# EAGLE design power_board (EAGLE 8.0.2)
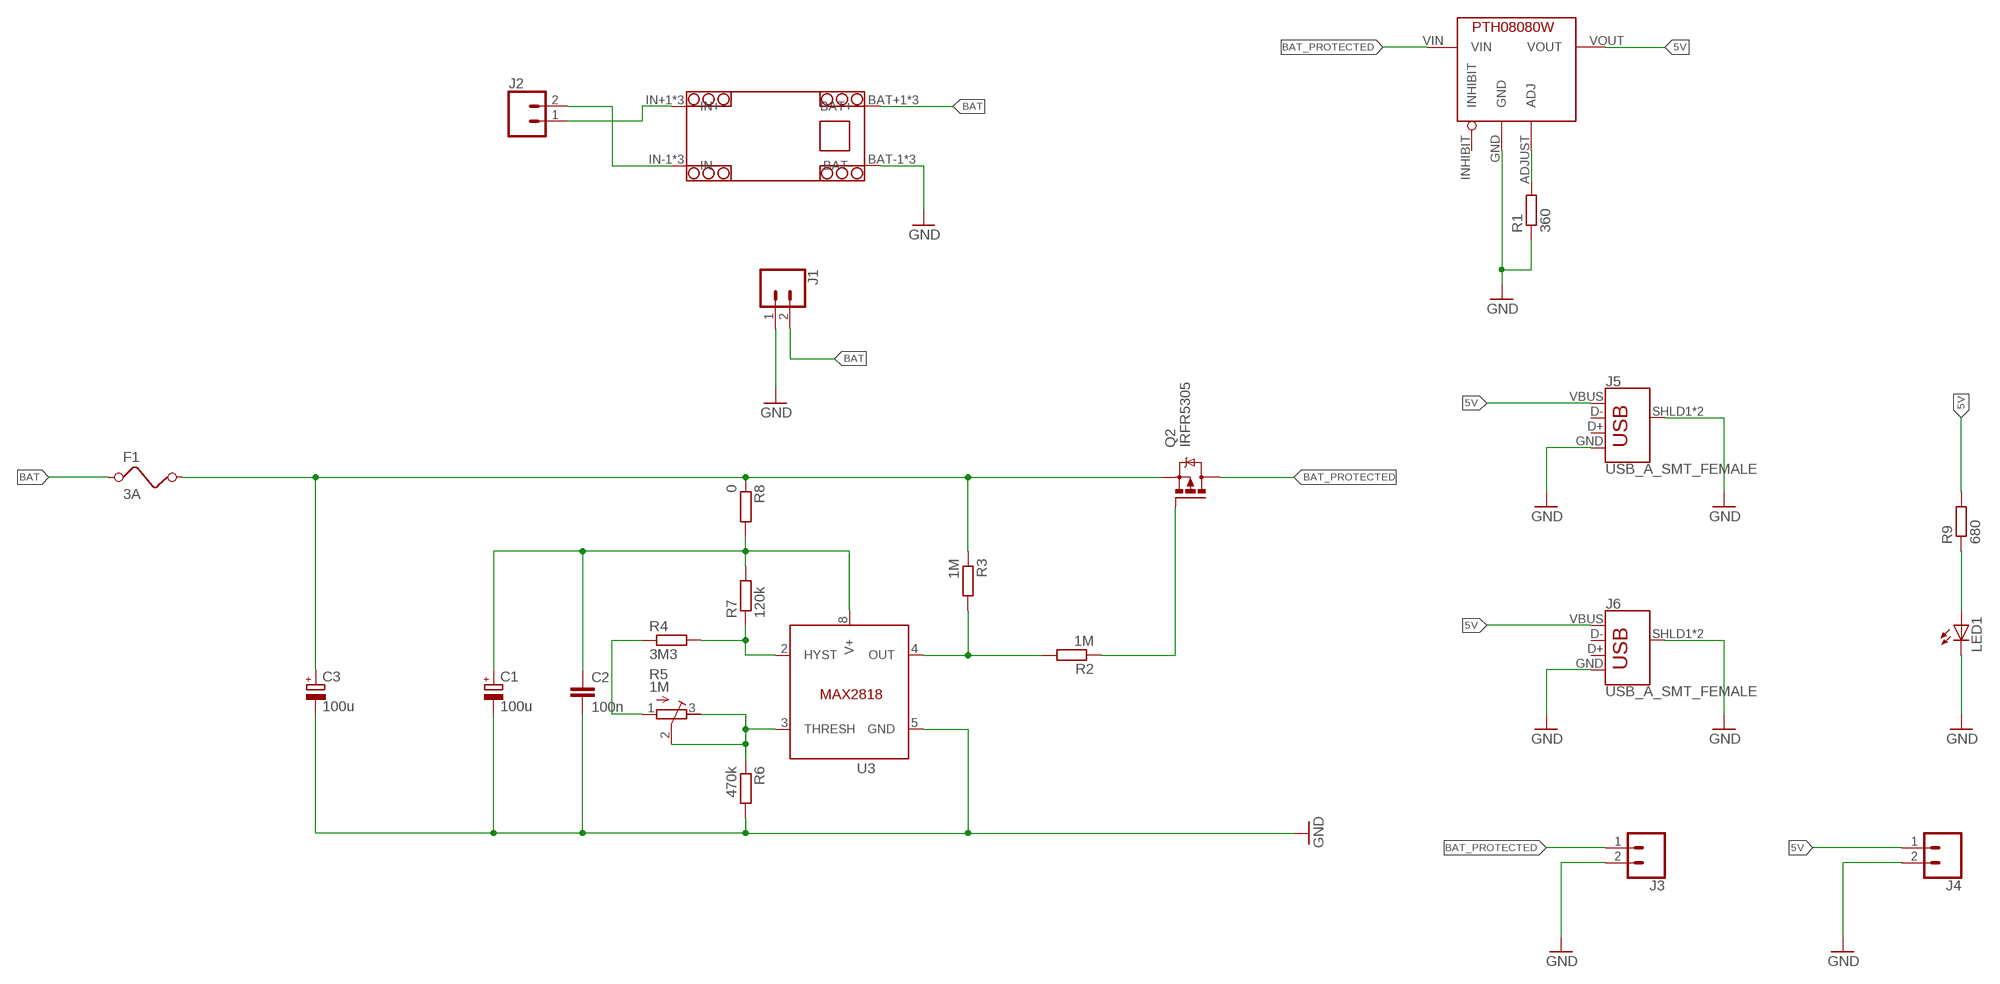
[diagram p0: schematic, sheet 1]

## Parts
C1  100u  CPOL-EUE3.5-8  [E3,5-8]
C2  100n  C-EUC1206  [C1206]
C3  100u  CPOL-EUE3.5-8  [E3,5-8]
F1  3A  FUSE  [FUSE]
J1  CONN_025MM  [SCREWTERMINAL-5MM-2]
J2  CONN_025MM  [SCREWTERMINAL-5MM-2]
J3  CONN_02  [1X02]
J4  CONN_025MM  [SCREWTERMINAL-5MM-2]
J5  USB_A_SMT_FEMALE  [USB-A-S-SILK-FEMALE]
J6  USB_A_SMT_FEMALE  [USB-A-S-SILK-FEMALE]
LED1  LED3MM  [LED3MM]
Q2  IRFR5305  [D-PAK_TO252AA]
R1  360  R-EU_R1206  [R1206]
R2  1M  R-EU_R1206  [R1206]
R3  1M  R-EU_R1206  [R1206]
R4  3M3  R-EU_R1206  [R1206]
R5  1M  R-TRIMM64Y  [RTRIM64Y]
R6  470k  R-EU_R1206  [R1206]
R7  120k  R-EU_R1206  [R1206]
R8  0  R-EU_R1206  [R1206]
R9  680  R-EU_R1206  [R1206]
U1  YZXSTUDIO_SOLARCHARGERDEFAULT  [YZXSTUDIO_SOLARCHARGER]
U2  PTH08080WPTH08080W  [PTH08080W]
U3  MAX2812MAX2812_SOIC8  [SOIC127P600X175-8N]

## Nets
5V: J4.1 J5.VBUS J6.VBUS R9.2 U2.VOUT
BAT: F1.1 J1.2 U1.BAT+1(BAT+) U1.BAT+2(BAT+) U1.BAT+3(BAT+)
BAT_FUSED: C3.+ F1.2 Q2.3(S) R3.1 R8.1
BAT_PROTECTED: J3.1 Q2.4(D) U2.VIN
GND: C1.- C2.2 C3.- J1.1 J3.2 J4.2 J5.GND J5.SHLD1(SHIELD) J5.SHLD2(SHIELD) J6.GND J6.SHLD1(SHIELD) J6.SHLD2(SHIELD) LED1.K(C) R1.1 R6.2 U1.BAT-1(BAT-) U1.BAT-2(BAT-) U1.BAT-3(BAT-) U2.GND U3.5(GND)
N$1: J2.2 U1.IN-1(IN-) U1.IN-2(IN-) U1.IN-3(IN-)
N$2: J2.1 U1.IN+1(IN+) U1.IN+2(IN+) U1.IN+3(IN+)
N$4: R1.2 U2.ADJUST(ADJ)
N$5: R5.2(S) R5.3(E) R6.1 U3.3(THRESH)
N$6: R2.2 R3.2 U3.4(OUT)
N$7: Q2.1(G) R2.1
N$8: C1.+ C2.1 R7.2 R8.2 U3.8(V+)
N$9: R4.2 R7.1 U3.2(HYST)
N$10: R4.1 R5.1(A)
N$12: LED1.A R9.1
Unconnected: J5.D+ J5.D- J6.D+ J6.D- U2.INHIBIT

## Library data of the parts
C1 C3 = rcl:CPOL-EU: POLARIZED CAPACITOR, European symbol
C2 = rcl:C-EU: CAPACITOR, European symbol
F1 = special:FUSE: FUSE 5 x 20 mm
J1 J2 J4 = SparkFun-Connectors:CONN_02: Multi connection point. Often used as Generic Header-pin footprint for 0.1 inch spaced/style header connections On any of the 0.1 inch spaced packages, you can populate with these: Break Away Headers - Straight <https://www.sparkfun.com/products/116> (PRT-00116) Break Away Male Headers - Right Angle <https://www.sparkfun.com/products/553> (PRT-00553) Female Headers <https://www.sparkfun.com/products/115> (PRT-00115) Break Away Headers - Machine Pin <https://www.sparkfun.com/products/117> (PRT-00117) Break Away Female Headers - Swiss Machine Pin <https://www.sparkfun.com/products/743> (PRT-00743) For SCREWTERMINALS and SPRING TERMINALS visit here: Screw Terimnals on SparkFun.com <https://www.sparkfun.com/search/results?term=Screw+Terminals> (5mm/3.5mm/2.54mm spacing) This device is also useful as a general connection point to wire up your design to another part of your project. Our various solder wires solder well into these plated through hole pads. Hook-Up Wire - Assortment (Stranded, 22 AWG) <https://www.sparkfun.com/products/11375> (PRT-11375) Hook-Up Wire - Assortment (Solid Core, 22 AWG) <https://www.sparkfun.com/products/11367> (PRT-11367) View the entire wire category on our website here <https://www.sparkfun.com/categories/141> Special notes: Molex polarized connector foot print use with: PRT-08233 with associated crimp pins and housings. 2.54_SCREWTERM for use with PRT-10571. 3.5mm Screw Terminal footprints for PRT-08084 5mm Screw Terminal footprints for use with PRT-08432; SF_SKU: PRT-08432
J3 = SparkFun-Connectors:CONN_02: Multi connection point. Often used as Generic Header-pin footprint for 0.1 inch spaced/style header connections On any of the 0.1 inch spaced packages, you can populate with these: Break Away Headers - Straight <https://www.sparkfun.com/products/116> (PRT-00116) Break Away Male Headers - Right Angle <https://www.sparkfun.com/products/553> (PRT-00553) Female Headers <https://www.sparkfun.com/products/115> (PRT-00115) Break Away Headers - Machine Pin <https://www.sparkfun.com/products/117> (PRT-00117) Break Away Female Headers - Swiss Machine Pin <https://www.sparkfun.com/products/743> (PRT-00743) For SCREWTERMINALS and SPRING TERMINALS visit here: Screw Terimnals on SparkFun.com <https://www.sparkfun.com/search/results?term=Screw+Terminals> (5mm/3.5mm/2.54mm spacing) This device is also useful as a general connection point to wire up your design to another part of your project. Our various solder wires solder well into these plated through hole pads. Hook-Up Wire - Assortment (Stranded, 22 AWG) <https://www.sparkfun.com/products/11375> (PRT-11375) Hook-Up Wire - Assortment (Solid Core, 22 AWG) <https://www.sparkfun.com/products/11367> (PRT-11367) View the entire wire category on our website here <https://www.sparkfun.com/categories/141> Special notes: Molex polarized connector foot print use with: PRT-08233 with associated crimp pins and housings. 2.54_SCREWTERM for use with PRT-10571. 3.5mm Screw Terminal footprints for PRT-08084 5mm Screw Terminal footprints for use with PRT-08432
J5 J6 = SparkFun-Connectors:USB_A: USB-A Connector Male and female variants, as well as PTH and SMT variants SparkFun Products: SparkFun XBee Explorer Dongle <https://www.sparkfun.com/products/11697> PTH Male SparkFun MicroView-USB Programmer <https://www.sparkfun.com/products/12924> SMT Male SparkFun USB Type A Female Breakout <https://www.sparkfun.com/products/12700> SMT Female; PROD_ID: CONN-09520; SF_ID: PRT-09011
LED1 = adafruit:LED: LED OSRAM: - CHIPLED LG R971, LG N971, LY N971, LG Q971, LY Q971, LO R971, LY R971 LH N974, LH R974 LS Q976, LO Q976, LY Q976 LO Q996 - Hyper CHIPLED LW Q18S LB Q993, LB Q99A, LB R99A - SideLED LS A670, LO A670, LY A670, LG A670, LP A670 LB A673, LV A673, LT A673, LW A673 LH A674 LY A675 LS A676, LA A676, LO A676, LY A676, LW A676 LS A679, LY A679, LG A679 - Hyper Micro SIDELED® LS Y876, LA Y876, LO Y876, LY Y876 LT Y87S - SmartLED LW L88C, LW L88S LB L89C, LB L89S, LG L890 LS L89K, LO L89K, LY L89K LS L896, LA L896, LO L896, LY L896 - TOPLED LS T670, LO T670, LY T670, LG T670, LP T670 LSG T670, LSP T670, LSY T670, LOP T670, LYG T670 LG T671, LOG T671, LSG T671 LB T673, LV T673, LT T673, LW T673 LH T674 LS T676, LA T676, LO T676, LY T676, LB T676, LH T676, LSB T676, LW T676 LB T67C, LV T67C, LT T67C, LS T67K, LO T67K, LY T67K, LW E67C LS E67B, LA E67B, LO E67B, LY E67B, LB E67C, LV E67C, LT E67C LW T67C LS T679, LY T679, LG T679 LS T770, LO T770, LY T770, LG T770, LP T770 LB T773, LV T773, LT T773, LW T773 LH T774 LS E675, LA E675, LY E675, LS T675 LS T776, LA T776, LO T776, LY T776, LB T776 LHGB T686 LT T68C, LB T68C - Hyper Mini TOPLED® LB M676 - Mini TOPLED Santana® LG M470 LS M47K, LO M47K, LY M47K Source: http://www.osram.convergy.de/
Q2 = transistor-power:IRF?5305: HEXFET Power MOSFET Source: http://www.irf.com/product-info/datasheets/data/irfr5305pbf.pdf
R1-R4 R6-R9 = rcl:R-EU_: RESISTOR, European symbol
R5 = rcl:R-TRIMM: Trimm resistor
U1 = custom_adluc:YZXSTUDIO_SOLARCHARGER
U2 = custom_adluc:PTH08080W
U3 = custom_adluc:MAX2812

## Board
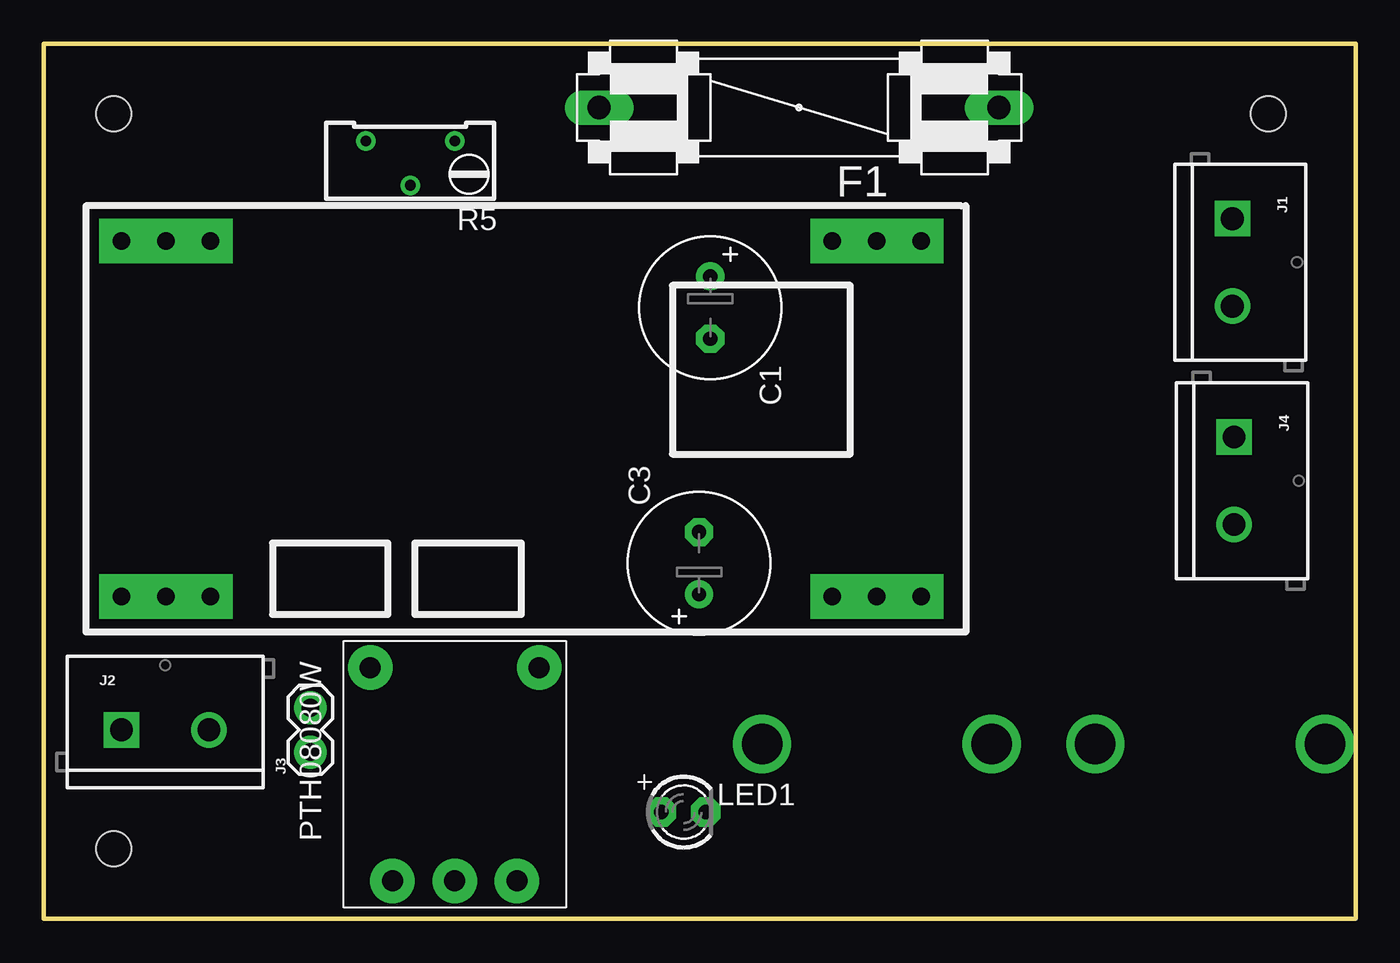
[diagram p1: board, top side]
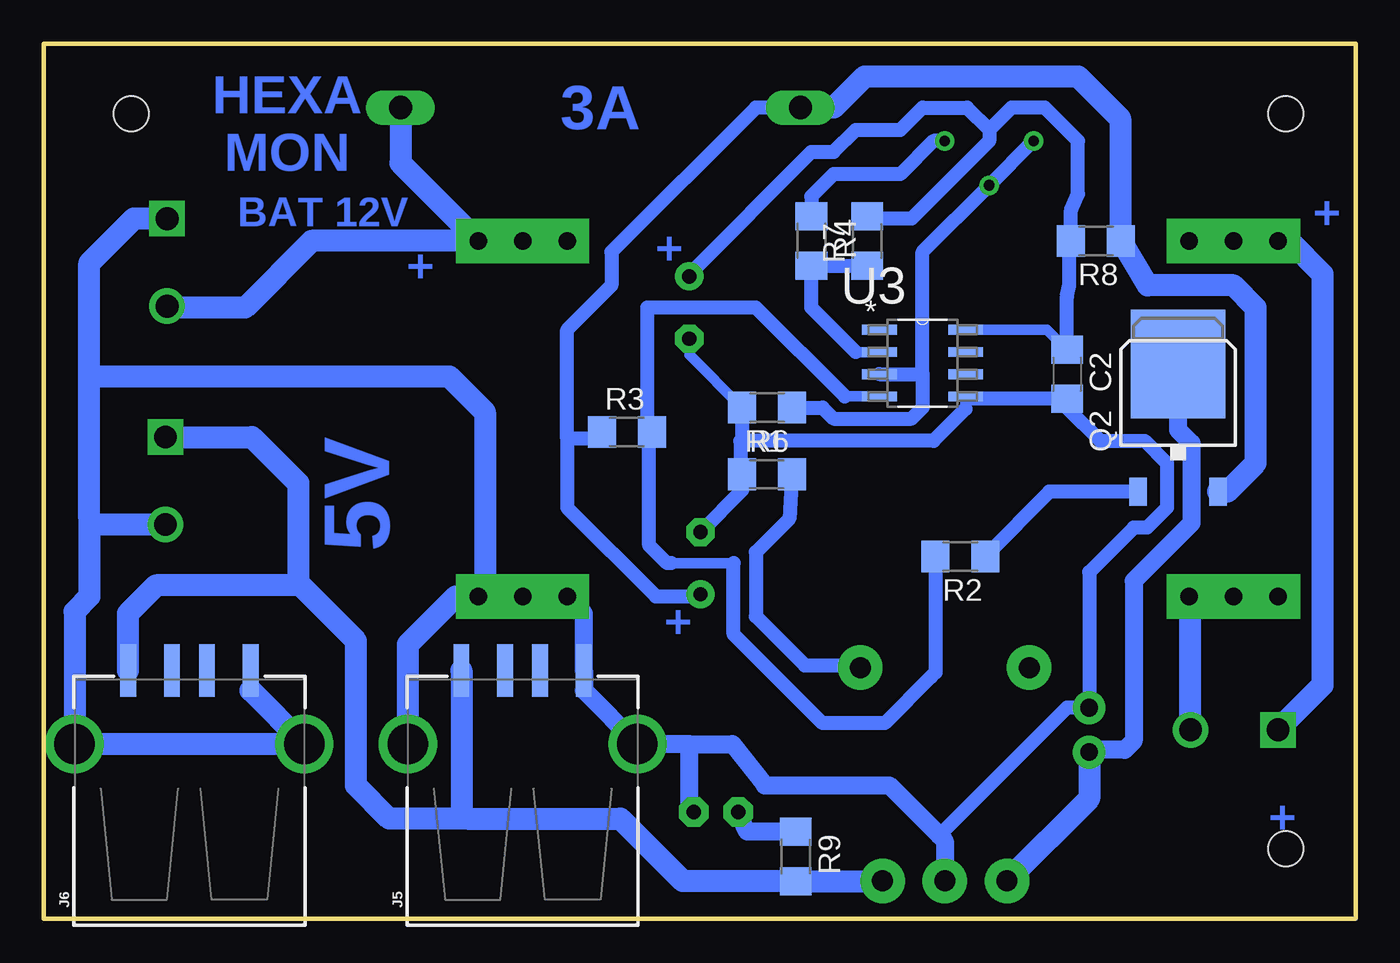
[diagram p2: board, bottom side, seen from below]

Size 75 x 50 mm. Coordinates in mm from the lower left corner, seen from the top.
Outline: 0,0 75,0 75,50 0,50 0,0
Copper layers (1*16): Top 0.035mm / dielectric 1.5mm / Bottom 0.035mm
Design rules "default *": minimum track width 10mil, minimum drill 24mil, track to track 0.5mm, track to pad 0.5mm, pad to pad 8mil, via to via 8mil, smd to smd 8mil, copper to edge 40mil, drill to drill 8mil, minimum pad ring 10mil, minimum via ring 8mil, stop-mask expansion 4mil, vias tented up to drill 0mil, thermal gap 10mil
Holes 2 mm at 4,46 70,46 4,4

### Footprints (pad centres in the part's own frame; a part is rotated, then mirrored left to right if it is on the bottom)
E3,5-8 = drill 0.813 pad 1.6: + -1.778,0 | drill 0.813 pad 1.6 octagon: - 1.778,0
C1206 = smd 1.6 x 1.8: 1 -1.4,0; 2 1.4,0
FUSE = drill 1.321 long: 1 -11.43,0; 2 11.43,0
SCREWTERMINAL-5MM-2 = drill 1.3 pad 2.032 square: 1 0,0 | drill 1.3 pad 2.032: 2 5,0
1X02 = drill 1.016 pad 1.88: 1 0,0; 2 2.54,0
USB-A-S-SILK-FEMALE = smd 3 x 0.9: D+ 7.212,-1; D- 7.212,1; GND 7.212,-3.5; VBUS 7.212,3.5 | drill 2.311: SHLD1 3,-6.566; SHLD2 3,6.566
LED3MM = drill 0.813 pad 1.676 octagon: A -1.27,0; K 1.27,0
D-PAK_TO252AA = smd 1 x 1.6: 1 -2.28,-4.8; 3 2.28,-4.8 | smd 5.4 x 6.2: 4 0,2.5
R1206 = smd 1.6 x 1.803: 1 -1.422,0; 2 1.422,0
RTRIM64Y = drill 0.61: 1 0,-2.54; 2 -2.54,0; 3 0,2.54
YZXSTUDIO_SOLARCHARGER = drill 1 pad 2.54 square: BAT+1 40.64,0; BAT+2 43.18,0; BAT+3 45.72,0; BAT-1 40.64,-20.32; BAT-2 43.18,-20.32; BAT-3 45.72,-20.32; IN+1 0,0; IN+2 2.54,0; IN+3 5.08,0; IN-1 0,-20.32; IN-2 2.54,-20.32; IN-3 5.08,-20.32
PTH08080W = drill 1.2 pad 2.54: ADJUST 13.716,-11.176; GND 1.524,-6.35; INHIBIT 13.716,-1.524; VIN 1.524,-2.794; VOUT 1.524,-9.906
SOIC127P600X175-8N = smd 1.981 x 0.559: 1 -2.464,1.905; 2 -2.464,0.635; 3 -2.464,-0.635; 4 -2.464,-1.905; 5 2.464,-1.905; 6 2.464,-0.635; 7 2.464,0.635; 8 2.464,1.905

### Placement (x,y rotation side)
C1  38.1,34.92 270 top
C2  16.51,31.11 270 bottom
C3  37.47,20.32 90 top
F1  43.18,46.35 180 top
J1  67.94,40.01 270 top
J2  4.45,10.79 0 top
J3  15.24,9.53 90 top
J4  68.04,27.53 270 top
J5  47.62,6.99 90 bottom
J6  66.67,6.99 90 bottom
LED1  36.58,6.1 0 top
Q2  10.16,29.21 0 bottom
R1  33.66,25.4 0 bottom
R2  22.61,20.7 180 bottom
R3  41.66,27.81 0 bottom
R4  31.11,38.73 270 bottom
R5  20.95,44.45 90 top
R6  33.66,29.21 180 bottom
R7  27.94,38.73 90 bottom
R8  14.86,38.73 180 bottom
R9  32,3.56 270 bottom
U1  4.45,38.73 0 top
U2  17.14,0.64 90 top
U3  24.77,31.75 0 bottom

### Tracks (layer width: path | path; a pad name or v marks a point on that pad's centre or on a via)
5V
  Bottom 0.813: 51.12,6.04 50.8,5.71
  Bottom 1.016: 60.45,19.18 60.33,19.05 | 32,2.16 R9.2 | 27.05,2.13 U2.VOUT
  Bottom 1.27: J6.VBUS 70.17,17.45 68.58,19.05 60.33,19.05 57.15,15.88 57.15,7.62 55.24,5.71 50.8,5.71 42.04,5.71 38.48,2.16 32,2.16 | J5.VBUS 51.12,6.04 | J4.1 63.09,27.53 60.45,24.89 60.45,19.18 | R9.2 27.05,2.13
BAT
  Bottom 1.016: U1.BAT+3 U1.BAT+2 U1.BAT+1 | 67.86,34.92 J1.2
  Bottom 1.27: F1.1 54.61,43.18 U1.BAT+3 59.69,38.73 63.5,34.92 67.86,34.92
BAT_FUSED
  Bottom 0.254: C3.+ 37.47,18.41
  Bottom 0.61: 13.46,38.76 R8.1 | C3.+ 37.59,18.41
  Bottom 0.813: F1.2 34.29,46.35 42.55,38.1 42.55,36.2 45.09,33.66 45.09,27.43 | 45.09,27.43 45.09,23.5 40.01,18.41 37.59,18.41 | R3.1 43.31,27.81 43.69,27.43 45.09,27.43
  Bottom 1.27: Q2.3 7.34,24.41 5.71,26.04 5.71,34.92 6.99,36.2 11.91,36.2 R8.1 | F1.2 29.84,46.35 28.07,48.13 15.88,48.13 13.46,45.72 13.46,38.76
BAT_PROTECTED
  Bottom 1.016: Q2.4 10.16,27.94 9.4,27.18 9.4,22.61 12.7,19.3 12.7,10.16 13.21,9.65 15.11,9.65 J3.1
  Bottom 1.27: J3.1 15.24,6.86 U2.VIN
GND
  Bottom 0.254: 41.09,10.18 J5.SHLD1 | 44.11,13.95 J5.GND | 34.92,25.4 R1.1 | R6.2 34.92,29.21
  Bottom 0.61: 16.51,29.21 C2.2 | 22.17,29.71 U3.5 22.3,29.13 | 35.08,27.46 35.18,27.3 | 35.18,25.3 R1.1 | C1.- 38.1,32.23 R6.2
  Bottom 0.813: 23.81,4.76 16.51,12.06 J3.2 15.24,19.81 12.7,22.35 11.94,22.35 10.79,23.5 10.79,26.04 12.06,27.3 14.61,27.3 16.51,29.21 | C2.2 22.17,29.71 | 22.3,29.13 24.13,27.3 35.18,27.3 35.18,25.3 | R6.2 35.08,27.46 | R1.1 35.08,24.49 C3.- | J6.GND 63.17,13.05
  Bottom 1.016: 38.1,9.98 J5.SHLD1 44.12,13.05 J5.GND 44.12,17.45 U1.BAT-1 U1.BAT-2 U1.BAT-3 49.78,18.8 | 38.1,9.98 35.64,9.98 33.78,7.62 26.67,7.62 23.81,4.76 23.5,4.45 U2.GND | 72.06,22.53 72.39,22.86 | LED1.K 38.1,6.1 38.1,9.98
  Bottom 1.27: U1.BAT-3 51.44,18.41 54.19,15.66 J5.SHLD2 | 63.17,13.05 J6.SHLD1 J6.SHLD2 73.24,17.56 72.39,18.41 72.39,22.86 72.39,30.99 | J1.1 69.85,40.01 72.39,37.47 72.39,30.99 | J4.2 72.06,22.53 | 72.39,30.99 51.82,30.99 49.78,28.96 49.78,18.8
N$1
  Bottom 0.813: 9.45,18.34 U1.IN-3
  Bottom 1.27: J2.2 9.45,18.34 | U1.IN-3 U1.IN-2 U1.IN-1
N$2
  Bottom 0.813: U1.IN+1 3.81,38.73
  Bottom 1.27: U1.IN+3 U1.IN+2 U1.IN+1 | 3.81,38.73 1.91,36.83 1.91,13.34 J2.1
N$4
  Bottom 0.61: 28.45,14.48 U2.ADJUST
  Bottom 0.813: R1.2 32.38,22.86 34.29,20.95 34.29,17.27 31.5,14.48 28.45,14.48
N$5
  Bottom 0.813: R5.3 R5.2 24.77,38.1 24.77,31.11 | R6.1 30.48,29.21 29.84,28.57 25.4,28.57 24.77,29.21 24.77,31.11 | U3.3 24.77,31.11
N$6
  Bottom 0.61: 37.47,34.92 36.83,34.92 | U3.4 29.21,29.84 | 35.56,20.32 39.12,20.32
  Bottom 0.813: 29.21,29.84 34.29,34.92 37.47,34.92 40.51,34.92 40.51,28.04 R3.2 40.39,27.66 40.39,21.34 39.37,20.32 39.12,20.32 | 35.56,20.32 35.56,16.26 30.48,11.18 26.92,11.18 24.28,13.82 24.03,14.07 R2.2
N$7
  Bottom 0.813: Q2.1 17.53,24.41 R2.1
N$8
  Bottom 0.61: C1.+ 38.1,36.83 | 27.79,40.01 R7.2 | 16.38,38.58 R8.2 | U3.8 17.65,33.66 C2.1
  Bottom 0.813: 38.1,36.83 31.11,43.81 29.84,43.81 28.57,45.09 26.04,45.09 24.77,46.35 22.23,46.35 20.95,45.09 | R8.2 16.28,40.49 15.88,41.4 15.88,44.45 17.78,46.35 19.68,46.35 20.95,45.09 | 20.95,45.09 20.95,44.45 25.4,40.01 27.79,40.01 | C2.1 16.51,35.56 16.38,36.2 16.38,38.58
N$9
  Bottom 0.61: U3.2 28.57,32.38
  Bottom 0.813: 28.57,32.38 31.11,34.92 R4.2 R7.1
N$10
  Bottom 0.813: R5.1 24.13,44.45 26.04,42.55 29.84,42.55 31.11,41.27 R4.1
N$12
  Bottom 1.016: R9.1 34.8,4.98 LED1.A

### Text on the board
Bottom: 3A | HEXA / MON | + | BAT 12V | + | + | 5V | + | +